# Altium schematic sheet PWR_PoE_PD_1000BASE-T.SchDoc
size 420 x 297 mm; SheetNumber: 4; SheetTotal: 32; DocumentTypeShort: Э3; DocumentInvertoryNumber: ㅤ
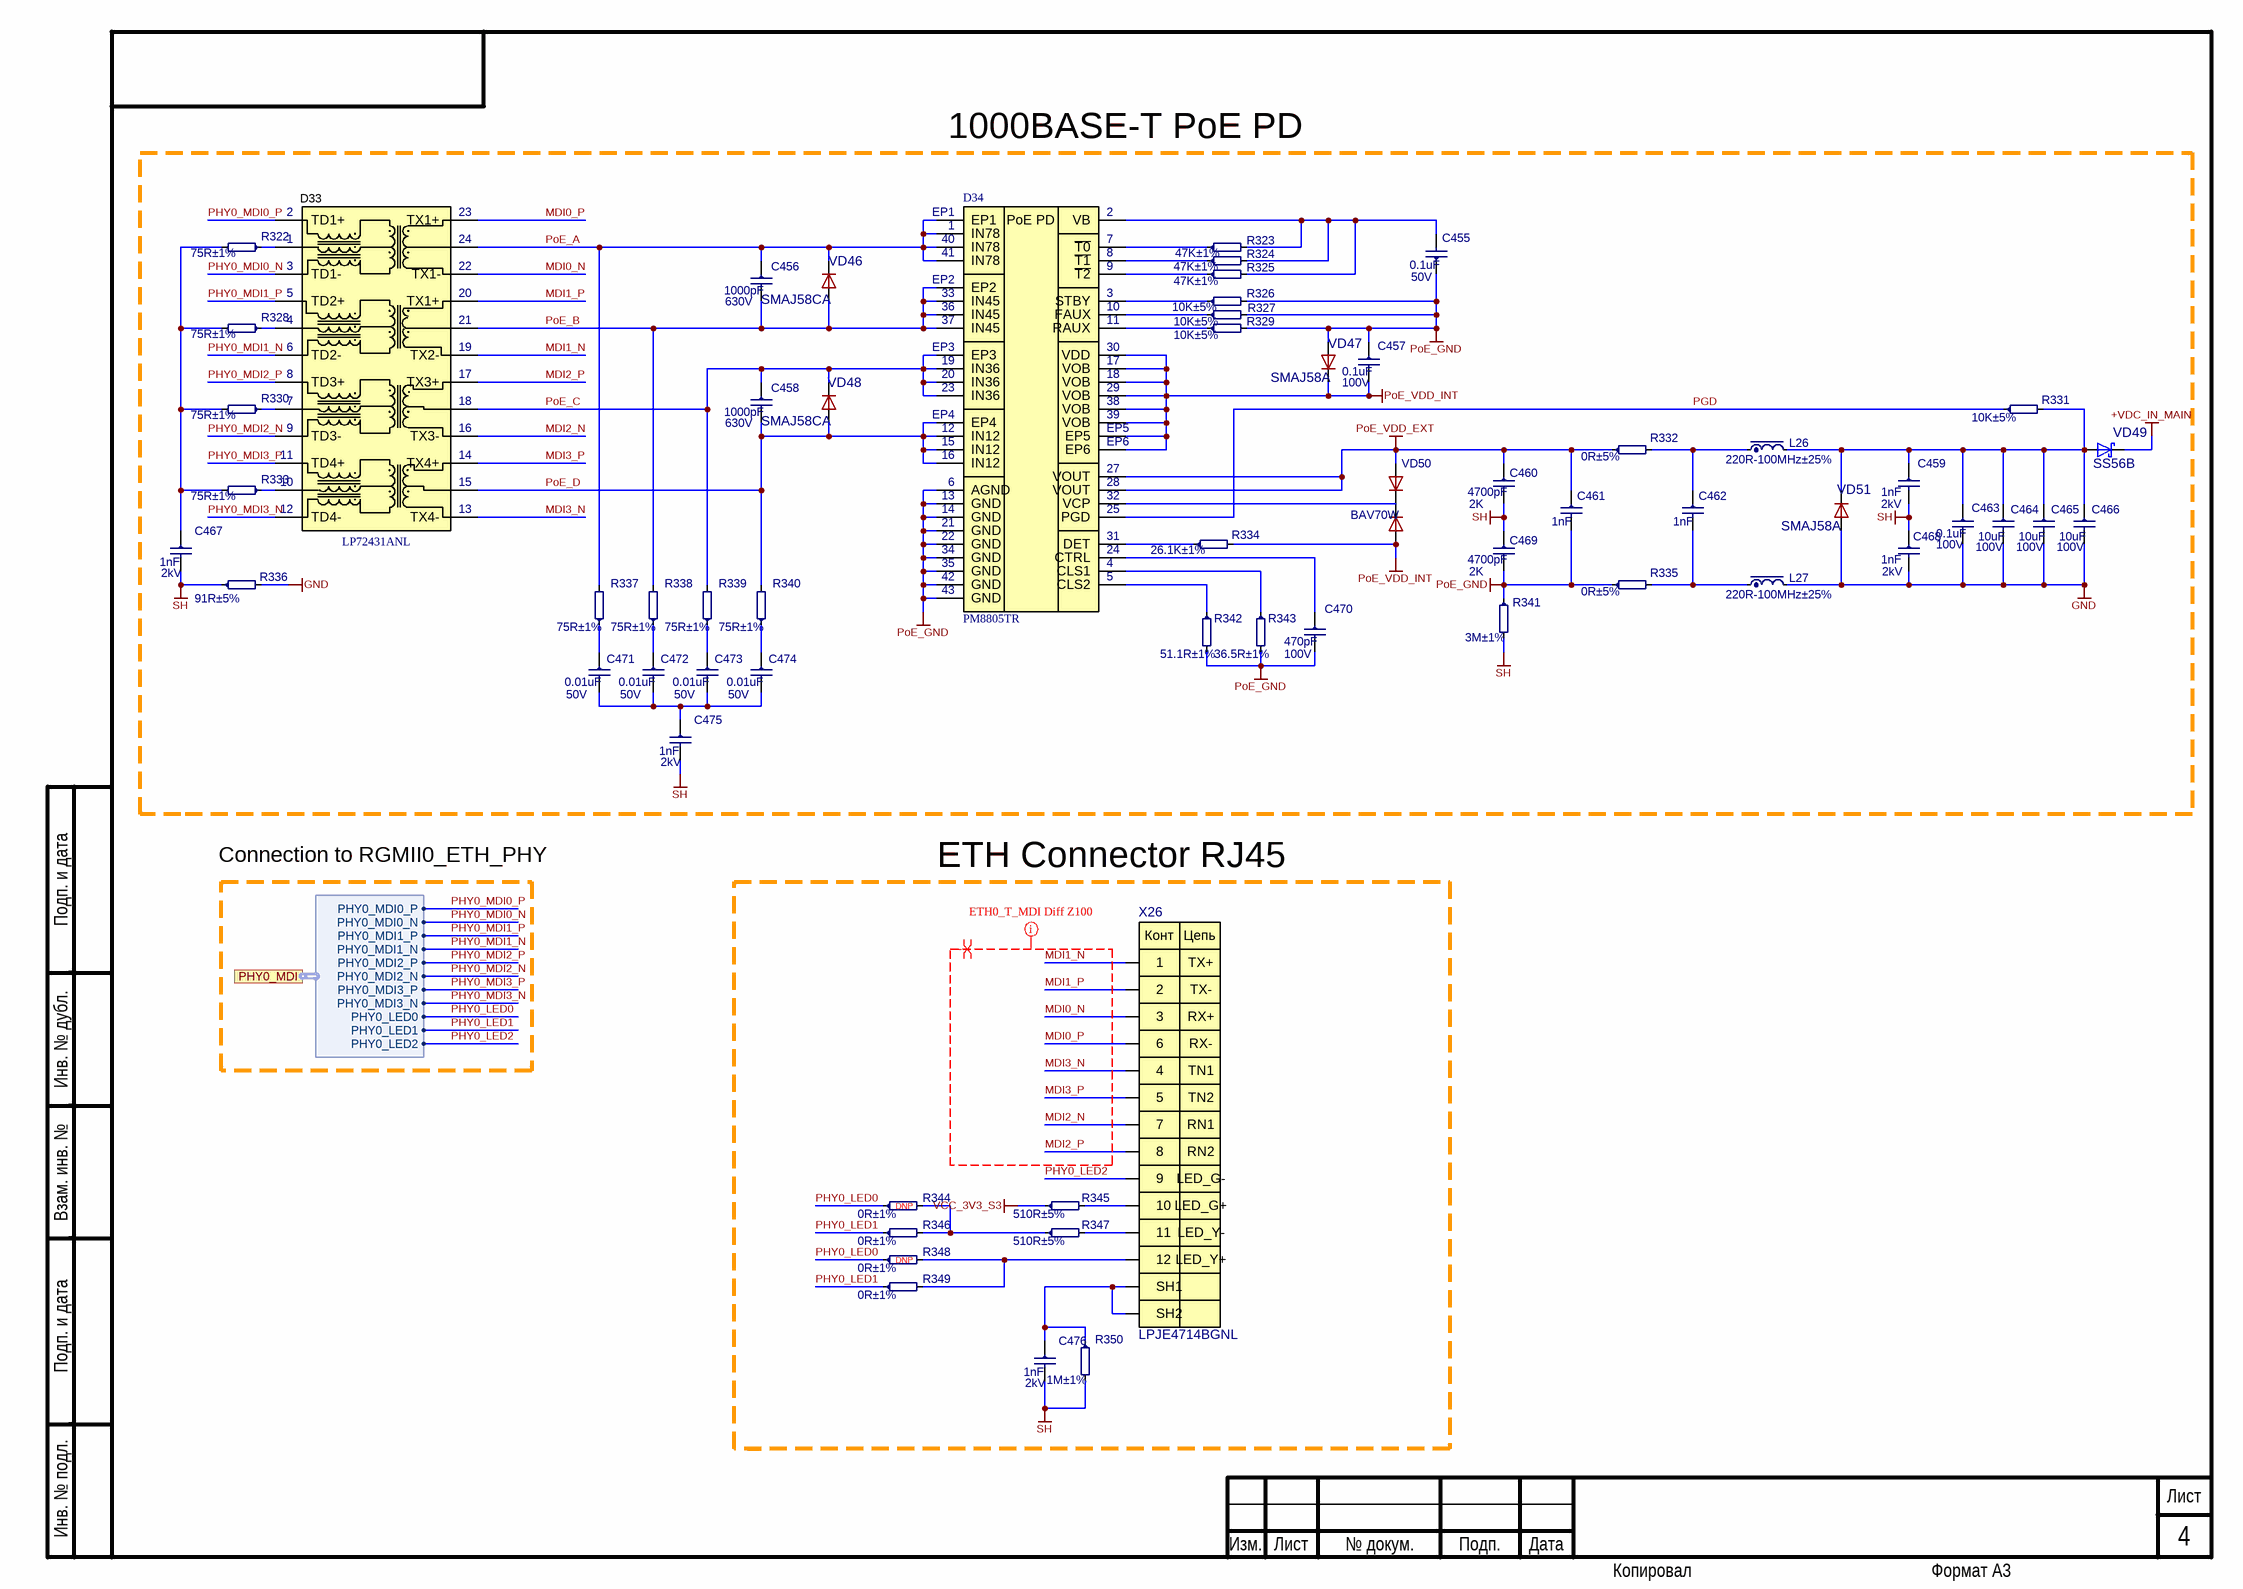
[diagram p0: PWR_PoE_PD_1000BASE-T.SchDoc]

## Parts
C455  0.1uF  Voltage: 50V  [C0603]
C456  1000pF  Voltage: 630V  [C1206]
C457  0.1uF  Voltage: 100V  [C1206]
C458  1000pF  Voltage: 630V  [C1206]
C459  1nF  Voltage: 2kV  [C1812]
C460  4700pF  Voltage: 2K  [C1206]
C461  1nF  [C1206]
C462  1nF  [C1206]
C463  0.1uF  Voltage: 100V  [C1206]
C464  10uF  Voltage: 100V  [C1210]
C465  10uF  Voltage: 100V  [C1210]
C466  10uF  Voltage: 100V  [C1210]
C467  1nF  Voltage: 2kV  [C1812]
C468  1nF  Voltage: 2kV  [C1812]
C469  4700pF  Voltage: 2K  [C1206]
C470  470pF  Voltage: 100V  [C0805]
C471  0.01uF  Voltage: 50V  [C0603]
C472  0.01uF  Voltage: 50V  [C0603]
C473  0.01uF  Voltage: 50V  [C0603]
C474  0.01uF  Voltage: 50V  [C0603]
C475  1nF  Voltage: 2kV  [C1812]
C476  1nF  Voltage: 2kV  [C1812]
D33  LP72431ANL  [LP72431ANL]
D34  PM8805TR  [PM8805TR]
L26  220R-100MHz±25%  [L0805]
L27  220R-100MHz±25%  [L0805]
R322  75R±1%  [R0603]
R323  47K±1%  [R0402]
R324  47K±1%  [R0402]
R325  47K±1%  [R0402]
R326  10K±5%  [R0402]
R327  10K±5%  [R0402]
R328  75R±1%  [R0603]
R329  10K±5%  [R0402]
R330  75R±1%  [R0603]
R331  10K±5%  [R1206]
R332  0R±5%  [R1206]
R333  75R±1%  [R0603]
R334  26.1K±1%  [R0603]
R335  0R±5%  [R1206]
R336  91R±5%  [R2010]
R337  75R±1%  [R0603]
R338  75R±1%  [R0603]
R339  75R±1%  [R0603]
R340  75R±1%  [R0603]
R341  3M±1%  [R1206]
R342  51.1R±1%  [R0805]
R343  36.5R±1%  [R0805]
R344  0R±1%  [R0402]
R345  510R±5%  [R0402]
R346  0R±1%  [R0402]
R347  510R±5%  [R0402]
R348  0R±1%  [R0402]
R349  0R±1%  [R0402]
R350  1M±1%  [R1206]
VD46  SMAJ58CA  [DO-214AC]
VD47  SMAJ58A  [DO-214AC]
VD48  SMAJ58CA  [DO-214AC]
VD49  SS56B  [DO-214AA]
VD50  BAV70W  [SOT323]
VD51  SMAJ58A  [DO-214AC]
X26  LPJE4714BGNL  [LPJE4714BGNL]

## Ports
PHY0_MDI (harness PHY0_MDI)

## Harnesses
PHY0_MDI: PHY0_MDI0_N, PHY0_MDI1_P, PHY0_MDI1_N, PHY0_MDI2_P, PHY0_MDI0_P, PHY0_MDI2_N, PHY0_MDI3_P, PHY0_MDI3_N, PHY0_LED0, PHY0_LED1, PHY0_LED2

## Nets
+VDC_IN_MAIN: VD49.1(K)
GND: C463.2 C464.2 C465.2 C466.2 C468.2 L27.2 R336.2 VD51.2(A)
PoE_GND: C455.1 C457.1 C461.2 C469.2 C470.2 D34.6(AGND) D34.13(GND) D34.14(GND) D34.21(GND) D34.22(GND) D34.34(GND) D34.35(GND) D34.42(GND) D34.43(GND) R326.2 R327.2 R329.2 R335.1 R341.1 R342.2 R343.2 VD47.2(A)
PoE_VDD_EXT: C460.1 C461.1 D34.27(VOUT) D34.28(VOUT) R332.1 VD50.1(A)
PoE_VDD_INT: C457.2 D34.17(VOB) D34.18(VOB) D34.29(VOB) D34.30(VDD) D34.38(VOB) D34.39(VOB) D34.EP5 D34.EP6 R334.2 VD47.1(C) VD50.2(A)
SH: C459.2 C460.2 C467.2 C468.1 C469.1 C475.2 C476.2 R336.1 R341.2 R350.2
VCC_3V3_S3: R345.1
MDI0_N: D33.22(TX1-) X26.3
MDI0_P: D33.23(TX1+) X26.6
MDI1_N: D33.19(TX2-) X26.1
MDI1_P: D33.20(TX1+) X26.2
MDI2_N: D33.16(TX3-) X26.7
MDI2_P: D33.17(TX3+) X26.8
MDI3_N: D33.13(TX4-) X26.4
MDI3_P: D33.14(TX4+) X26.5
PGD: D34.25(PGD) R331.1
PHY0_LED0: R344.1 R348.1 ; port PHY0_MDI.PHY0_LED0
PHY0_LED1: R346.1 R349.1 ; port PHY0_MDI.PHY0_LED1
PHY0_LED2: X26.9 ; port PHY0_MDI.PHY0_LED2
PHY0_MDI0_N: D33.3(TD1-) ; port PHY0_MDI.PHY0_MDI0_N
PHY0_MDI0_P: D33.2(TD1+) ; port PHY0_MDI.PHY0_MDI0_P
PHY0_MDI1_N: D33.6(TD2-) ; port PHY0_MDI.PHY0_MDI1_N
PHY0_MDI1_P: D33.5(TD2+) ; port PHY0_MDI.PHY0_MDI1_P
PHY0_MDI2_N: D33.9(TD3-) ; port PHY0_MDI.PHY0_MDI2_N
PHY0_MDI2_P: D33.8(TD3+) ; port PHY0_MDI.PHY0_MDI2_P
PHY0_MDI3_N: D33.12(TD4-) ; port PHY0_MDI.PHY0_MDI3_N
PHY0_MDI3_P: D33.11(TD4+) ; port PHY0_MDI.PHY0_MDI3_P
PoE_A: C456.1 D33.24(TCT_1) D34.1(IN78) D34.40(IN78) D34.41(IN78) D34.EP1 R337.2 VD46.1(C)
PoE_B: C456.2 D33.21(TCT_2) D34.33(IN45) D34.36(IN45) D34.37(IN45) D34.EP2 R338.2 VD46.2(A)
PoE_C: C458.1 D33.18(TCT_3) D34.19(IN36) D34.20(IN36) D34.23(IN36) D34.EP3 R339.2 VD48.1(C)
PoE_D: C458.2 D33.15(TCT_4) D34.12(IN12) D34.15(IN12) D34.16(IN12) D34.EP4 R340.2 VD48.2(A)
NetC455_2: C455.2 D34.2(VB) R323.2 R324.2 R325.2
NetC459_1: C459.1 C463.1 C464.1 C465.1 C466.1 L26.2 R331.2 VD49.2(A) VD51.1(C)
NetC462_1: C462.1 L26.1 R332.2
NetC462_2: C462.2 L27.1 R335.2
NetC467_1: C467.1 R322.2 R328.2 R330.2 R333.2
NetC470_1: C470.1 D34.24(CTRL)
NetC471_1: C471.1 R337.1
NetC471_2: C471.2 C472.2 C473.2 C474.2 C475.1
NetC472_1: C472.1 R338.1
NetC473_1: C473.1 R339.1
NetC474_1: C474.1 R340.1
NetC476_1: C476.1 R350.1 X26.SH1 X26.SH2
NetD33_1: D33.1(TCT1) R322.1
NetD33_4: D33.4(TCT2) R328.1
NetD33_7: D33.7(TCT3) R330.1
NetD33_10: D33.10(TCT4) R333.1
NetD34_3: D34.3(STBY) R326.1
NetD34_4: D34.4(CLS1) R343.1
NetD34_5: D34.5(CLS2) R342.1
NetD34_7: D34.7(~{T0}) R323.1
NetD34_8: D34.8(~{T1}) R324.1
NetD34_9: D34.9(~{T2}) R325.1
NetD34_10: D34.10(FAUX) R327.1
NetD34_11: D34.11(RAUX) R329.1
NetD34_31: D34.31(DET) R334.1
NetD34_32: D34.32(VCP) VD50.3(CC)
NetR344_2: R344.2 R346.2 R347.1
NetR345_2: R345.2 X26.10
NetR347_2: R347.2 X26.11
NetR348_2: R348.2 R349.2 X26.12

## Layout directives
net class T_MDI: MDI0_N, MDI0_P, MDI1_N, MDI1_P, MDI2_N, MDI2_P, MDI3_N, MDI3_P
differential pair; differential pair class Diff_Z100: MDI0_N, MDI0_P, MDI1_N, MDI1_P, MDI2_N, MDI2_P, MDI3_N, MDI3_P

## Notes on the sheet
- 1000BASE-T PoE PD
- Connection to RGMII0_ETH_PHY
- ETH Connector RJ45
- (near R344) DNP
- (near R348) DNP
- Подп. и дата
- Инв. № дубл.
- Взам. инв. №
- Инв. № подл.
- Изм.
- Лист
- № докум.
- Подп.
- Дата
- Копировал
- Формат А3
- (in symbol LPJE4714BGNL) Конт; Цепь; TX+; TX-; RX+; RX-; TN1; TN2; RN1; RN2; LED_G-; LED_G+; LED_Y-; LED_Y+
- (in symbol PM8805TR) PoE PD

## Library data of the parts
C455 = 0603-X7R-50V-0.1uF±10%: Manufacturer: Yageo; NameFromManufacturer: CC0603KRX7R9BB104; Dielectric: X7R; Place: *); Tolerance: 10%; Check: False; Case: C0603; Part Number: 0603-X7R-50V-0.1uF±10%; Value: 0.1uF; Temperature: -55°C~125°C; ComponentLink2Description: Link to datasheet; ComponentLink1Description: DATASHEET; ComponentLink2URL: https://www.yageo.com/upload/media/product/productsearch/datasheet/mlcc/UPY-GPHC_X7R_6.3V-to-50V_18.pdf; ComponentLink1URL: Datasheets/capacitors/UPY-GPHC_X7R_6.3V-to-50V_18.pdf; Last changed: 27.10.2022
C456 C458 = 1206-NP0-630V-1000pF±5%: Manufacturer: Yageo; NameFromManufacturer: AC1206JKNPOZBN102; Dielectric: NP0; Place: *); Tolerance: 5%; Check: False; Case: C1206; Part Number: 1206-NP0-630V-1000pF±5%; Value: 1000pF; Temperature: -55°C~125°C; ComponentLink2Description: Link to datasheet; ComponentLink1Description: DATASHEET; ComponentLink2URL: https://www.yageo.com/upload/media/product/productsearch/datasheet/mlcc/UPY-AC_NP0X7R_16V-to-630V_12.pdf; ComponentLink1URL: Datasheets/capacitors/grm1555c1h2r2ca01-01-6256770.pdf; Last changed: 27.10.2022
C457 C463 = 1206-X7R-100V-0.1uF±10%: Manufacturer: KEMET; NameFromManufacturer: C1206C104K1RAC7800; Dielectric: X7R; Place: *); Tolerance: 10%; Check: False; Case: C1206; Part Number: 1206-X7R-100V-0.1uF±10%; Value: 0.1uF; Temperature: -55°C~125°C; ComponentLink2Description: Link to datasheet; ComponentLink1Description: DATASHEET; ComponentLink2URL: https://ru.mouser.com/ProductDetail/KEMET/C1206C104K1RAC7800?qs=iEvsikg1EVxARPY%252B1Vujbw%3D%3D; ComponentLink1URL: Datasheets/capacitors/C1206C104K1RACTU.pdf; Last changed: 27.10.2022
C459 C467 C468 C475 C476 = 1812-C0G-2kV-1uF±10%: *; Part Number: 1812-C0G-2kV-1nF±10%; Manufacturer: FH; NameFromManufacturer: 1812B102K202NT; Dielectric: C0G; Place: *); Tolerance: 5%; Check: False; Case: CASE; Value: 1nF; Temperature: -55°C~125°C; ComponentLink2Description: Link to datasheet; ComponentLink1Description: DATASHEET; ComponentLink2URL: https://octopart.com/1812ga102jat2a-avx-75165070?r=sp; ComponentLink1URL: Datasheets/capacitors/C0GNP0-Dielectric.pdf; Last changed: 27.10.2022
C460 C469 = 1206-X7R-1K-4700pF±10%: Part Number: 1206-X7R-2K-4700pF±10%; Manufacturer: FH; NameFromManufacturer: 1206B472K202NT; Dielectric: X7R; Place: *); Tolerance: 10%; Check: False; Case: C1206; Value: 4700pF; Temperature: -55°C~125°C; ComponentLink2Description: Link to datasheet; ComponentLink1Description: DATASHEET; ComponentLink2URL: https://www.terraelectronica.ru/product/577491; ComponentLink1URL: Datasheets/capacitors/UPY-NP0X7R_HV_500V-to-3KV_15.pdf; Last changed: 27.10.2022
C461 C462 = 1206-X7R-2K-1000pF±10%: Ceramic Capacitor 1206 1nF ±10% 2kV X7R; Manufacturer: Yageo; NameFromManufacturer: CC1206KKX7RDBB102; Place: *); Analog: 1206B102K202; Check: False; Dielectric: X7R; Voltage: 2kV; Case: C1206; Part Number: 1206-X7R-2K-1000pF±10%; Value: 1nF; Tolerance: 10%; Temperature: -55°C~125°C; ComponentLink2Description: Link to datasheet; ComponentLink1Description: DATASHEET; ComponentLink2URL: https://www.lcsc.com/product-detail/Multilayer-Ceramic-Capacitors-MLCC-SMD-SMT_YAGEO-CC1206KKX7RDBB102_C23631.html; Last changed: 09.04.2025
C464-C466 = 1210-X7S-100V-10uF±10%: Manufacturer: Samsung Electro-Mechanics; NameFromManufacturer: CL32Y106KCVZNWE; Dielectric: X7S; Place: *); Tolerance: 10%; Check: False; Case: C1210; Part Number: 1210-X7S-100V-10uF±10%; Value: 10uF; Temperature: -55°C~125°C; ComponentLink2Description: Link to datasheet; ComponentLink1Description: DATASHEET; ComponentLink2URL: https://www.digikey.com/en/products/detail/samsung-electro-mechanics/CL32Y106KCVZNWE/15992073; ComponentLink1URL: Datasheets/capacitors/CL32Y106KCVZNWE_Spec.pdf; Last changed: 27.10.2022
C470 = 0805-X7R-16V-0.33uF±10%: Part Number: 0805-X7R-100V-470pF±10%; Manufacturer: Yageo; NameFromManufacturer: CC0805JRNPO0BN471; Dielectric: X7R; Place: *); Tolerance: 10%; Check: False; Case: C0805; Value: 470pF; Temperature: -55°C~125°C; ComponentLink2Description: Link to datasheet; ComponentLink1Description: DATASHEET; ComponentLink2URL: https://www.digikey.com/en/products/detail/yageo/CC0805KKX7R7BB334/5195288; ComponentLink1URL: Datasheets/capacitors/UPY-GPHC_X7R_6.3V-to-50V_20.pdf; Last changed: 27.10.2022
C471-C474 = 0603-X7R-50V-0.01uF±10%: Manufacturer: Yageo; NameFromManufacturer: CC0603KRX7R9BB103; Dielectric: X7R; Place: *); Tolerance: 10%; Check: False; Case: C0603; Part Number: 0603-X7R-50V-0.01uF±10%; Value: 0.01uF; Temperature: -55°C~125°C; ComponentLink2Description: Link to datasheet; ComponentLink1Description: DATASHEET; ComponentLink2URL: https://www.yageo.com/upload/media/product/productsearch/datasheet/mlcc/UPY-GPHC_X7R_6.3V-to-50V_18.pdf; ComponentLink1URL: Datasheets/capacitors/UPY-GPHC_X7R_6.3V-to-50V_20.pdf; Last changed: 27.10.2022
D33 = LP72431ANL: Manufacturer: LINK-PP; Check: False; ComponentType: *; Manufacter: *; Voltage: *; ClassName: *; Tolerance: *; PartNumber: LP72431ANL; Package: LP72431ANL; Part Number: LP72431ANL; NameFromManufacturer: LP72431ANL; Value: LP72431ANL
D34 = PM8805TR: Manufacturer: ST; Check: False; Part Number: PM8805TR; NameFromManufacturer: PM8805TR; Value: PM8805TR
L26 L27 = 0805-3A-120R-100MHz: *; Part Number: 0805-3A-220R-100MHz; Manufacturer: TDK; NameFromManufacturer: MPZ2012S221AT000; Current: 3A; Place: *); Tolerance: 25%; DC Resistance: 0.03R; Check: False; Case: L0805; Value: 220R-100MHz; Temperature: -55°C~125°C; ComponentLink1Description: DATASHEET; ComponentLink1URL: https://www.terraelectronica.ru/product/854541; Datasheet: Datasheets/inductors/QNFA9102.pdf; Last changed: 27.10.2022
R322 R328 R330 R333 R337-R340 = 0603-0.1W-75R-100ppm±1%: *; NameFromManufacturer: RC0603FR-0775RL; Manufacturer: Yageo; Place: *); Value: 75R; Tolerance: 1%; Check: False; Case: R0603; Part Number: 0603-0.1W-75R-100ppm±1%; Temperature: -55°C~155°C; ComponentLink1Description: DATASHEET; ComponentLink1URL: https://octopart.com/rc0603fr-0775rl-yageo-1432518?r=sp; Datasheet: Datasheets/resistors/RC0603.pdf; Last changed: 27.10.2022
R323-R325 = 0402-0.0625W-47K-100ppm±1%: NameFromManufacturer: RC0402FR-0747KL; Manufacturer: Yageo; Place: *); Value: 47K; Tolerance: 1%; Check: False; Case: R0402; Part Number: 0402-0.0625W-47K-100ppm±1%; Temperature: -55°C~155°C; ComponentLink1Description: DATASHEET; ComponentLink1URL: https://www.terraelectronica.ru/pdf/show?pdf_file=%252Fds%252Fpdf%252FR%252FRC0402.pdf; Datasheet: Datasheets/resistors/PYu-RC_Group_51_RoHS_L_12.pdf; Last changed: 27.10.2022
R326 R327 R329 = 0402-0.0625W-10K-100ppm±5%: NameFromManufacturer: RC0402JR-0710KL; Manufacturer: Yageo; Place: *); Value: 10K; Tolerance: 5%; Check: False; Case: R0402; Part Number: 0402-0.0625W-10K-100ppm±5%; Temperature: -55°C~155°C; ComponentLink1Description: DATASHEET; ComponentLink1URL: https://ru.mouser.com/ProductDetail/YAGEO/RC0402JR-0710KL?qs=%2Fha2pyFadugNN0LzwXn2qF8HRAp201xOpXu%252BapQnyvRGE%2F%252Bpr1TWjQ%3D%3D; Datasheet: Datasheets/resistors/PYu-RC_Group_51_RoHS_L_11.pdf; Last changed: 27.10.2022
R331 = 1206-0.25W-10K-100ppm±5%: NameFromManufacturer: RC1206JR-1310KL; Manufacturer: Yageo; Place: *); Value: 10K; Tolerance: 5%; Check: False; Case: R1206; Part Number: 1206-0.25W-10K-100ppm±5%; Temperature: -55°C~155°C; ComponentLink1Description: DATASHEET; ComponentLink1URL: https://www.digikey.com/en/products/detail/yageo/RC1206JR-1310KL/14286743; Datasheet: Datasheets/resistors/PYu-RC_Group_51_RoHS_L_11.pdf; Last changed: 27.10.2022
R332 R335 = 1206-0.25W-0R-200ppm±5%: NameFromManufacturer: RC1206JR-070RL; Manufacturer: Yageo; Place: *); Value: 0R; Tolerance: 5%; Check: False; Case: R1206; Part Number: 1206-0.25W-0R-200ppm±5%; Temperature: -55°C~155°C; ComponentLink1Description: DATASHEET; ComponentLink1URL: https://www.yageo.com/upload/media/product/productsearch/datasheet/rchip/PYu-RC_Group_51_RoHS_L_11.pdf; Datasheet: Datasheets/resistors/PYu-RC_Group_51_RoHS_L_11.pdf; Last changed: 27.10.2022
R334 = 0603-0.1W-26.1K-100ppm±1%: NameFromManufacturer: NRC06F2612TRF; Manufacturer: NIC Components Corp.; Place: *); Value: 26.1K; Tolerance: 1%; Check: False; Case: R0603; Part Number: 0603-0.1W-26.1K-100ppm±1%; Temperature: -55°C~155°C; ComponentLink1Description: DATASHEET; ComponentLink1URL: https://www.xonelec.com/mpn/nic/nrc06f2612trf; Datasheet: Datasheets/resistors/NRC06F2612TRF-datasheet-pdf-ru.findic.com.pdf#Datasheets\resistors\NRC06F2612TRF-datasheet-pdf-ru.findic.com.pdf#; Last changed: 07.11.2022
R336 = 2010-0.75W-0R-200ppm±5%: Chip Resistor 2010 0Ω ±5% 200V ±200ppm/℃ Thick Film; Part Number: 2010-0.75W-91R-200ppm±5%; NameFromManufacturer: CL2010JN91RB; Manufacturer: CHANGLONG; Place: *); Value: 91R; Check: False; Case: R2010; Tolerance: 5%; Temperature: -55°C~155°C; ComponentLink1Description: DATASHEET; ComponentLink1URL: https://www.lcsc.com/product-detail/Chip-Resistor-Surface-Mount_YAGEO-RC2010JK-070RL_C152156.html; Last changed: 16.07.2024
R341 = 1206-0.25W-1M-100ppm±1%: Chip Resistor 1206 3MΩ ±1% 200V ±100ppm/℃ Thick Film; Part Number: 1206-0.25W-3M-100ppm±1%; NameFromManufacturer: NQ06W4F3004T5E; Manufacturer: UNI-ROYAL; Place: *); Value: 3M; Check: False; Case: R1206; Tolerance: 1%; Temperature: -55°C~155°C; ComponentLink1Description: DATASHEET; ComponentLink1URL: https://www.lcsc.com/product-detail/Chip-Resistor-Surface-Mount_YAGEO-RC1206FR-071ML_C108083.html?s_z=n_RC1206FR-071ML; Last changed: 09.04.2025
R342 = 0805-0.125W-200R-100ppm±1%: Chip Resistor 0805 200Ω ±1% 150V ±100ppm/℃ Thick Film; Part Number: 0805-0.125W-51.1R-100ppm±1%; NameFromManufacturer: RT0805BRD0751R1L; Manufacturer: YAGEO; Place: *); Value: 51.1R; Check: False; Case: R0805; Tolerance: 1%; Temperature: -55°C~125°C; ComponentLink1Description: DATASHEET; ComponentLink1URL: https://www.lcsc.com/product-detail/Chip-Resistor-Surface-Mount_YAGEO-RC0805FR-07200RL_C114567.html; Datasheet: #Datasheets\resistors\WR08X3300FTL-datasheet-pdf-ru.findic.com.pdf#; Last changed: 07.11.2022
R343 = 0805-0.125W-200R-100ppm±1%: Chip Resistor 0805 200Ω ±1% 150V ±100ppm/℃ Thick Film; Part Number: 0805-0.125W-36.5R-100ppm±1%; NameFromManufacturer: 0805W8F365JT5E; Manufacturer: UNI-ROYAL; Place: *); Value: 36.5R; Check: False; Case: R0805; Tolerance: 1%; Temperature: -55°C~125°C; ComponentLink1Description: DATASHEET; ComponentLink1URL: https://www.lcsc.com/product-detail/Chip-Resistor-Surface-Mount_YAGEO-RC0805FR-07200RL_C114567.html; Datasheet: #Datasheets\resistors\WR08X3300FTL-datasheet-pdf-ru.findic.com.pdf#; Last changed: 07.11.2022
R344 R346 R348 R349 = 0402-0.0625W-0R-100ppm±1%: Chip Resistor 0402 0Ω ±1% 50V ±100ppm/℃ Thick Film; NameFromManufacturer: RC0402FR-070RL; Manufacturer: Yageo; Place: *); Value: 0R; Check: False; Case: R0402; Part Number: 0402-0.0625W-0R-100ppm±1%; Tolerance: 1%; Temperature: -55°C~155°C; ComponentLink1Description: DATASHEET; ComponentLink1URL: https://www.chipdip.ru/product0/8000617426?ysclid=l7og5x0plo427794326; Datasheet: Datasheets/resistors/DOC012445956.pdf; Last changed: 27.10.2022
R345 R347 = 0402-0.0625W-510R-100ppm±5%: NameFromManufacturer: RC0402JR-07510RL; Manufacturer: Yageo; Place: *); Value: 510R; Tolerance: 5%; Check: False; Case: R0402; Part Number: 0402-0.0625W-510R-100ppm±5%; Temperature: -55°C~155°C; ComponentLink1Description: DATASHEET; ComponentLink1URL: https://www.digikey.com/en/products/detail/yageo/RC0402JR-07510RL/726490; Datasheet: Datasheets/resistors/PYu-RC_Group_51_RoHS_L_11.pdf; Last changed: 27.10.2022
R350 = 1206-0.25W-1M-100ppm±1%: Chip Resistor 1206 1MΩ ±1% 200V ±100ppm/℃ Thick Film; NameFromManufacturer: RC1206FR-071ML; Manufacturer: Yageo; Place: *); Value: 1M; Check: False; Case: R1206; Part Number: 1206-0.25W-1M-100ppm±1%; Tolerance: 1%; Temperature: -55°C~155°C; ComponentLink1Description: DATASHEET; ComponentLink1URL: https://www.lcsc.com/product-detail/Chip-Resistor-Surface-Mount_YAGEO-RC1206FR-071ML_C108083.html?s_z=n_RC1206FR-071ML; Last changed: 09.04.2025
VD46-VD48 VD51 = SMAJ58AE3/TR13: surface mount 500 W Transient Voltage Suppressor; Manufacturer: Littelfuse; Place: *); Check: False; Temperature: -55°C~150°C; ComponentLink1Description: DATASHEET; ComponentLink1URL: https://ru.mouser.com/ProductDetail/Microchip-Technology/SMAJ58AE3-TR13?qs=pU29NIZ4ZwDTkSPRv5fxkg%3D%3D; Datasheet: Datasheets/diodes/smaj5.0_to_smaj440ca_rev_c.pdf; Last changed: 27.10.2022
  VD46 VD48: Part Number: SMAJ58CA; Value: SMAJ58CA; NameFromManufacturer: SMAJ58CA
  VD47 VD51: Part Number: SMAJ58A; Value: SMAJ58A; NameFromManufacturer: SMAJ58A
VD49 = B360BQ-13-F: Schottky Rectifier; Manufacturer: Yangjie (YJ); Place: S; Check: False; Part Number: SS56B; Value: SS56B; Temperature: -55°C~150°C; NameFromManufacturer: SS56B; Last changed: 27.10.2022
VD50 = BAV70W: 70V Dual Common Cathode 1V 6ns 200mA SOT-323 Switching Diode; Manufacturer: LRC; NameFromManufacturer: LBAV70WT1G; Place: *); Check: False; Part Number: BAV70W; Value: BAV70W; Temperature: -55°C~150°C; ComponentLink1Description: DATASHEET; ComponentLink1URL: https://www.lcsc.com/product-detail/Switching-Diode_LRC-LBAV70WT1G_C383182.html; Last changed: 04.07.2024; Analog: BAV70W
X26 = LPJE4714BGNL: Manufacturer: LINK-PP; Check: False; Part Number: LPJE4714BGNL; Value: LPJE4714BGNL; NameFromManufacturer: LPJE4714BGNL